# Altium schematic sheet Power.SchDoc
size A4; DocumentNumber: 9; SheetNumber: 9; SheetTotal: 11
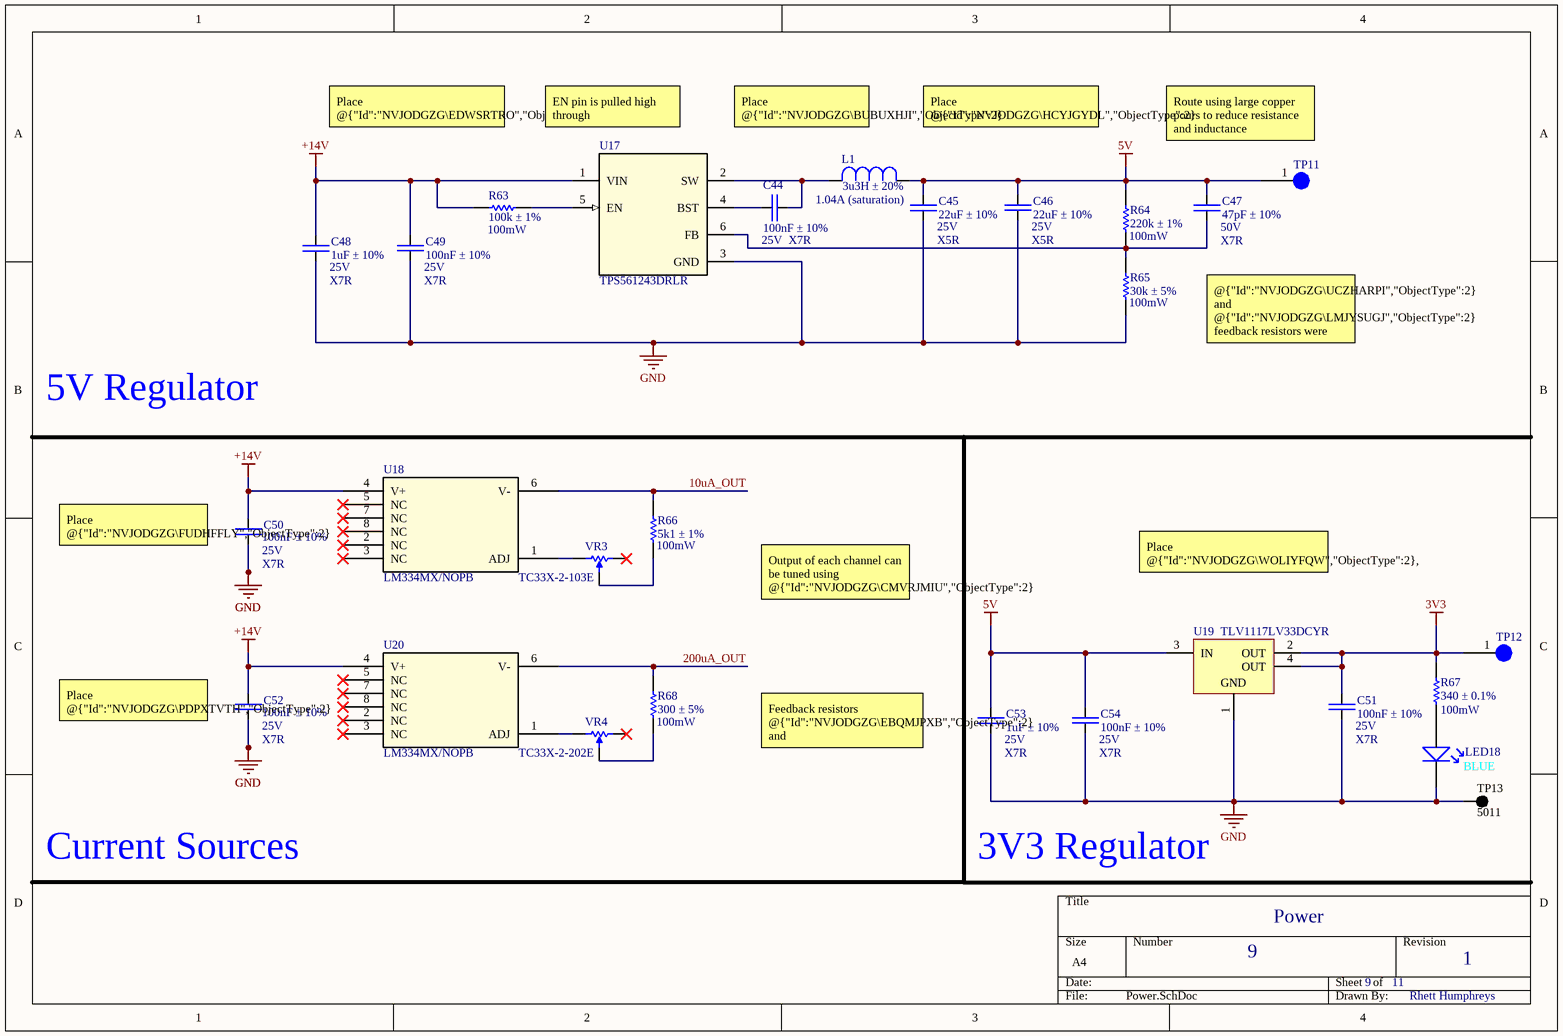
[diagram p0: Power.SchDoc]

## Parts
C44  100nF ± 10%  [CAP-0603]
C45  22uF ± 10%  [CAP-1206]
C46  22uF ± 10%  [CAP-1206]
C47  47pF ± 10%  [CAP-0603]
C48  1uF ± 10%  [CAP-0805]
C49  100nF ± 10%  [CAP-0603]
C50  100nF ± 10%  [CAP-0603]
C51  100nF ± 10%  [CAP-0603]
C52  100nF ± 10%  [CAP-0603]
C53  1uF ± 10%  [CAP-0805]
C54  100nF ± 10%  [CAP-0603]
L1  3u3H ± 20%  [IND_TAIYO_CBC3225_TAY]
LED18  (no value)  [0603 LED]
R63  100k ± 1%  [RES-0603]
R64  220k ± 1%  [RES-0603]
R65  30k ± 5%  [RES-0603]
R66  5k1 ± 1%  [RES-0603]
R67  340 ± 0.1%  [RES-0603]
R68  300 ± 5%  [RES-0603]
TP11  Test-Point 3mm  [TestPoint 3mm]  (value not drawn)
TP12  Test-Point 3mm  [TestPoint 3mm]  (value not drawn)
TP13  5011  [KSTN-5011_V]
U17  TPS561243DRLR  [DRL0006A-MFG]
U18  LM334MX/NOPB  [SO-8_STM]
U19  TLV1117LV33DCYR  [DCY0004A_N]
U20  LM334MX/NOPB  [SO-8_STM]
VR3  TC33X-2-103E  [BOUR-TC33X-2_V]
VR4  TC33X-2-202E  [BOUR-TC33X-2_V]

## Nets
3V3: C51.2 R67.1 TP12.1 U19.2(OUT) U19.4(OUT)
5V: C45.2 C46.2 C47.2 C53.2 C54.2 L1.1 R64.1 TP11.1 U19.3(IN)
+14V: C48.2 C49.2 C50.2 C52.2 R63.1 U17.1(VIN) U18.4(V+) U20.4(V+)
GND: C45.1 C46.1 C48.1 C49.1 C50.1 C51.1 C52.1 C53.1 C54.1 LED18.2 R65.2 TP13.1 U17.3(GND) U19.1(GND)
10uA_OUT: R66.1 U18.6(V-)
200uA_OUT: R68.1 U20.6(V-)
NetC44_1: C44.1 U17.4(BST)
NetC44_2: C44.2 L1.2 U17.2(SW)
NetC47_1: C47.1 R64.2 R65.1 U17.6(FB)
NetLED18_1: LED18.1 R67.2
NetR63_2: R63.2 U17.5(EN)
NetR66_2: R66.2 VR3.2
NetR68_2: R68.2 VR4.2
NetU18_1: U18.1(ADJ) VR3.1
NetU20_1: U20.1(ADJ) VR4.1

Not connected (* = marked no-connect by the designer): U18 2(NC)* 3(NC)* 5(NC)* 7(NC)* 8(NC)*; U20 2(NC)* 3(NC)* 5(NC)* 7(NC)* 8(NC)*; VR3 3*; VR4 3*

## Notes on the sheet
- Place @{"Id":"NVJODGZG\EDWSRTRO","ObjectType":2} and @{"Id":"NVJODGZG\DYNYEBZW","ObjectType":2} as close to @{"Id":"NVJODGZG\DGCAJXYF","ObjectType":2} as possible.
- EN pin is pulled high through @{"Id":"NVJODGZG\YICJOSXS","ObjectType":2}
- Place @{"Id":"NVJODGZG\BUBUXHJI","ObjectType":2} as close as possible to @{"Id":"NVJODGZG\DGCAJXYF","ObjectType":2}
- Place @{"Id":"NVJODGZG\HCYJGYDL","ObjectType":2} and @{"Id":"NVJODGZG\RJYCCXAY","ObjectType":2} as close as possible to @{"Id":"NVJODGZG\BUBUXHJI","ObjectType":2}.
- Route using large copper pours to reduce resistance and inductance
- (near R63) 100mW
- (near C44) 25V
- (near C44) X7R
- (near C45) 1.04A (saturation)
- (near C45) 25V
- (near C45) X5R
- (near C46) 25V
- (near C46) X5R
- (near R64) 100mW
- (near C47) X7R
- (near C47) 50V
- (near C48) X7R
- (near C48) 25V
- (near C49) X7R
- (near C49) 25V
- (near R65) 100mW
- @{"Id":"NVJODGZG\UCZHARPI","ObjectType":2} and @{"Id":"NVJODGZG\LMJYSUGJ","ObjectType":2} feedback resistors were chosen from @{"Id":"NVJODGZG\DGCAJXYF","ObjectType":2} datasheet for 5V typical application
- 5V Regulator
- (near C50) Place @{"Id":"NVJODGZG\FUDHFFLY","ObjectType":2} as close as possible to @{"Id":"NVJODGZG\QCNKAFLE","ObjectType":2}
- (near C50) X7R
- (near C50) 25V
- (near R66) 100mW
- Place @{"Id":"NVJODGZG\WOLIYFQW","ObjectType":2}, @{"Id":"NVJODGZG\OZZOURIS","ObjectType":2} and @{"Id":"NVJODGZG\DZOAGFNU","ObjectType":2} as close as possible to @{"Id":"NVJODGZG\AHGDDYNZ","ObjectType":2}.
- Output of each channel can be tuned using @{"Id":"NVJODGZG\CMVRJMIU","ObjectType":2} and @{"Id":"NVJODGZG\MRQRDVLR","ObjectType":2}.
- (near C52) Place @{"Id":"NVJODGZG\PDPXTVTH","ObjectType":2} as close as possible to @{"Id":"NVJODGZG\HQYKOPGT","ObjectType":2}
- (near R67) 100mW
- (near C52) X7R
- (near C52) 25V
- (near R68) 100mW
- Feedback resistors @{"Id":"NVJODGZG\EBQMJPXB","ObjectType":2} and @{"Id":"NVJODGZG\ZFYMTKTE","ObjectType":2} can be calculated using R_f = 0.067 / I_set
- (near C53) X7R
- (near C53) 25V
- (near C54) X7R
- (near C54) 25V
- (near C51) X7R
- (near C51) 25V
- BLUE
- Current Sources
- 3V3 Regulator
- Power
- 9
- 11
- 1
- Rhett Humphreys

## Library data of the parts
C44 C47 C49-C52 C54 = CAP-0603: Capacitor chip unpolarized. 0603
C45 C46 = CAP-1206: Capacitor chip unpolarized. 0603
C48 C53 = CAP-0805: Capacitor chip unpolarized. 0603
L1 = CBC3225T3R3MR: No Description Available; Mfr_Name: Taiyo Yuden
LED18 = 0603 LED
R63-R68 = RES-0603: Resistor chip. 0603
TP13 = CMP-1672-00003-4: Test Point, Black, Through Hole, RoHS, Bulk; Manufacturer: Keystone; ComponentLink2URL: http://www.keyelco.com/product-pdf.cfm?p=1320; Colour: Black; Pins: 1; REACH SVHC: No SVHC; ComponentLink1URL: http://www.keyelco.com/; PackageReference: 5011; Contact Plating: Silver; Package Quantity: 100; Packaging: Bulk; RoHSCompliant: true; Height: 8.12 mm; PackageDescription: 1-Pin Through Hole Device, Dia 3.17 mm; Mount: Through Hole; Mounting Technology: Through Hole; DatasheetVersion: Rev. F, 12/2013; ComponentLink1Description: Manufacturer URL; Contact Material: Bronze; ComponentLink2Description: Datasheet
U17 = TPS561243DRLR: No Description Available; Mfr_Name: Texas Instruments; TYPE: TYPE; RefDes: RefDes
U18 U20 = LM234DT: No Description Available; Mfr_Name: STMicroelectronics; RefDes: RefDes; Type: Type
U19 = CMP-0395-00503-2: Single Output LDO, 1 A, Fixed 3.3 V Output, 2 to 5.5 V Input, 4-pin SOT-223 (DCY), -40 to 125 degC, Green (RoHS & no Sb/Br); Manufacturer: Texas Instruments; Vout Adj(Min)(V): 3.3; Vdo(Typ)(mV): 1200; Iq(Typ)(mA): 0.05; Accuracy(%): 2; Iout(Max)(A): 1; SubFamily: Single Channel LDO; Vin(Max)(V): 5.5; PackageReference: DCY0004A; PackageDescription: 4-Pin Plastic Small Outline, Body 3.5 x 6.5 mm, Pitch 2.3 mm; Vout Adj(Max)(V): 3.3; Mounting Technology: Surface Mount; ComponentLink2Description: Datasheet; ComponentLink1Description: Manufacturer URL; PartNumber: TLV1117LV33DCYR; ComponentLink3Description: Package Specification; ComponentLink1URL: http://www.ti.com/; ComponentLink2URL: http://www.ti.com/general/docs/lit/getliterature.tsp?genericPartNumber=TLV1117LV33&fileType=pdf; Fixed Output Options(V): 3.3; PackageVersion: 4202506/B; Vin(Min)(V): 2; DatasheetVersion: SBVS160A; Eco-Plan: Green (RoHS & no Sb/Br); ComponentLink3URL: http://www.ti.com/litv/pdf/mpds094a; Code_JEDEC: TO-261
VR3 VR4 = CMP-2100-03695-1: Trimming Potentiometer, 2000 Ohm, -40 to 100 degC, 3-Pin SMD, RoHS, Tape and Reel; Manufacturer: Bourns; Tolerance: 25%; Max Power Dissipation: 100mW; Number of Turns: 1; Resistance: 10KOhm; Temperature Coefficient: 250ppm/degreesC; Voltage Rating (DC): 50V; Datasheet URL: http://www.bourns.com/docs/Product-Datasheets/TC33.pdf; Composition: Potentiometer; Package Description: 3-Pin Surface Mount Device, Body 3.8 x 3.6 mm; Weight: 29.4mg; Power Rating: 100mW; Termination: FootPrint; Manufacturer URL: http://www.bourns.com/; Width: 0.118inch; Height: 0.047inch; Military Standard: Not; Radiation Hardening: No; Colour: Silver; Case/Package: SMD/SMT; Depth: 3.8mm; Min Operating Temperature: -40degC; Lead Free: LeadFree; Datasheet Version: 42583.0; REACH SVHC: NoSVHC; Length: 3mm; RoHSCompliant: true; Contact Plating: Silver; Taper: Linear; Packaging: TapeandReel; Mount: SurfaceMount; Max Operating Temperature: 100degC; Package Reference: TC33X-2; Package Quantity: 2500